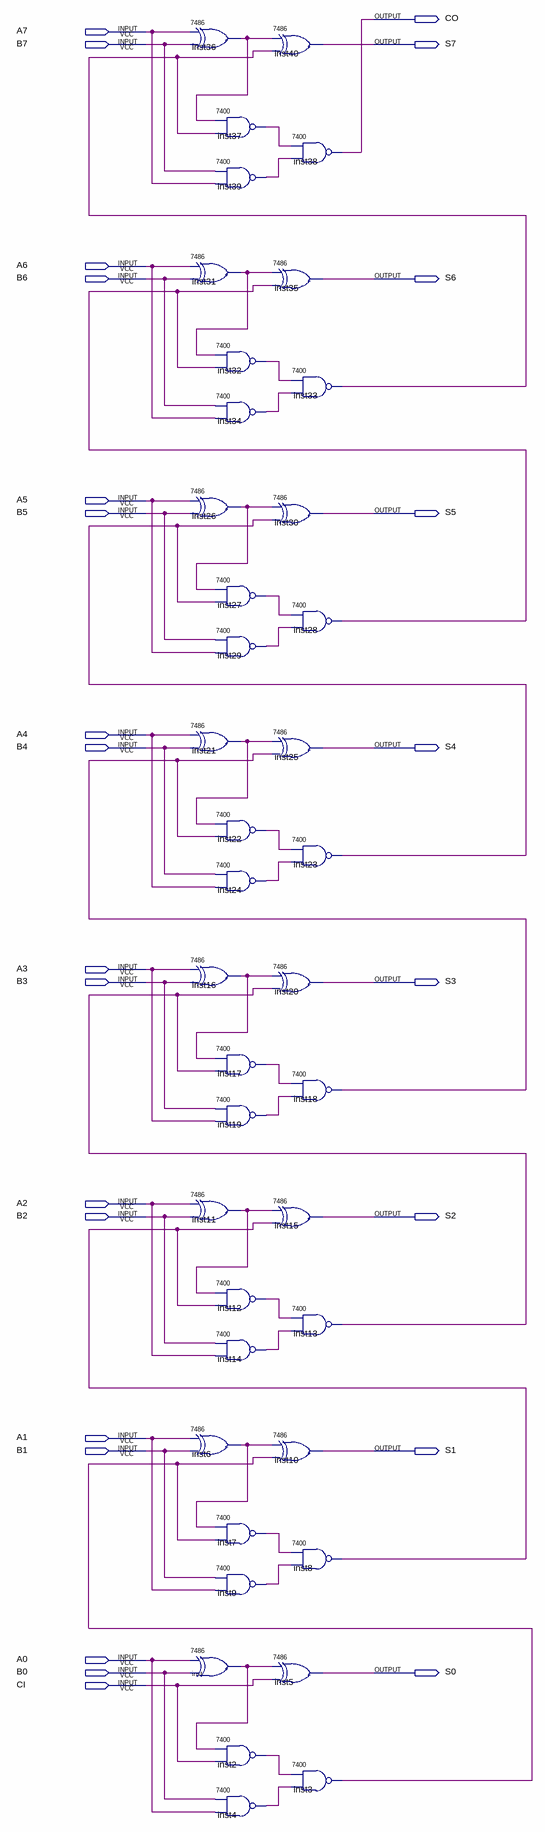
[diagram p0: schematic sheet]
// Quartus schematic adder_8b.bdf as structural Verilog: 40 symbols, 26 pins
module adder_8b (
  input  A7,
  input  B7,
  input  A6,
  input  B6,
  input  A5,
  input  B5,
  input  A4,
  input  B4,
  input  A3,
  input  B3,
  input  A2,
  input  B2,
  input  A1,
  input  B1,
  input  A0,
  input  B0,
  input  CI,
  output CO,
  output S7,
  output S6,
  output S5,
  output S4,
  output S3,
  output S2,
  output S1,
  output S0
);

  wire inst2_1, inst3_1, inst4_1, inst6_1, inst7_1, inst8_1, inst9_1, inst11_1, inst12_1, inst13_1, inst14_1,
       inst16_1, inst17_1, inst18_1, inst19_1, inst21_1, inst22_1, inst23_1, inst24_1, inst26_1, inst27_1,
       inst28_1, inst29_1, inst31_1, inst32_1, inst33_1, inst34_1, inst36_1, inst37_1, inst39_1, inst_1;

  \7486  inst36 (.\2 (A7), .\3 (B7), .\1 (inst36_1));
  \7400  inst37 (.\3 (inst33_1), .\2 (inst36_1), .\1 (inst37_1));
  \7400  inst39 (.\3 (A7), .\2 (B7), .\1 (inst39_1));
  \7486  inst31 (.\2 (A6), .\3 (B6), .\1 (inst31_1));
  \7400  inst32 (.\3 (inst28_1), .\2 (inst31_1), .\1 (inst32_1));
  \7400  inst34 (.\3 (A6), .\2 (B6), .\1 (inst34_1));
  \7486  inst26 (.\2 (A5), .\3 (B5), .\1 (inst26_1));
  \7400  inst27 (.\3 (inst23_1), .\2 (inst26_1), .\1 (inst27_1));
  \7400  inst29 (.\3 (A5), .\2 (B5), .\1 (inst29_1));
  \7486  inst21 (.\2 (A4), .\3 (B4), .\1 (inst21_1));
  \7400  inst22 (.\3 (inst18_1), .\2 (inst21_1), .\1 (inst22_1));
  \7400  inst24 (.\3 (A4), .\2 (B4), .\1 (inst24_1));
  \7486  inst16 (.\2 (A3), .\3 (B3), .\1 (inst16_1));
  \7400  inst17 (.\3 (inst13_1), .\2 (inst16_1), .\1 (inst17_1));
  \7400  inst19 (.\3 (A3), .\2 (B3), .\1 (inst19_1));
  \7486  inst11 (.\2 (A2), .\3 (B2), .\1 (inst11_1));
  \7400  inst12 (.\3 (inst8_1), .\2 (inst11_1), .\1 (inst12_1));
  \7400  inst14 (.\3 (A2), .\2 (B2), .\1 (inst14_1));
  \7486  inst6 (.\2 (A1), .\3 (B1), .\1 (inst6_1));
  \7400  inst7 (.\3 (inst3_1), .\2 (inst6_1), .\1 (inst7_1));
  \7400  inst9 (.\3 (A1), .\2 (B1), .\1 (inst9_1));
  \7486  inst (.\2 (A0), .\3 (B0), .\1 (inst_1));
  \7400  inst2 (.\3 (CI), .\2 (inst_1), .\1 (inst2_1));
  \7400  inst4 (.\3 (A0), .\2 (B0), .\1 (inst4_1));
  \7486  inst40 (.\2 (inst36_1), .\3 (inst33_1), .\1 (S7));
  \7486  inst35 (.\2 (inst31_1), .\3 (inst28_1), .\1 (S6));
  \7486  inst30 (.\2 (inst26_1), .\3 (inst23_1), .\1 (S5));
  \7486  inst25 (.\2 (inst21_1), .\3 (inst18_1), .\1 (S4));
  \7486  inst20 (.\2 (inst16_1), .\3 (inst13_1), .\1 (S3));
  \7486  inst15 (.\2 (inst11_1), .\3 (inst8_1), .\1 (S2));
  \7486  inst10 (.\2 (inst6_1), .\3 (inst3_1), .\1 (S1));
  \7486  inst5 (.\2 (inst_1), .\3 (CI), .\1 (S0));
  \7400  inst38 (.\3 (inst39_1), .\2 (inst37_1), .\1 (CO));
  \7400  inst33 (.\3 (inst34_1), .\2 (inst32_1), .\1 (inst33_1));
  \7400  inst28 (.\3 (inst29_1), .\2 (inst27_1), .\1 (inst28_1));
  \7400  inst23 (.\3 (inst24_1), .\2 (inst22_1), .\1 (inst23_1));
  \7400  inst18 (.\3 (inst19_1), .\2 (inst17_1), .\1 (inst18_1));
  \7400  inst13 (.\3 (inst14_1), .\2 (inst12_1), .\1 (inst13_1));
  \7400  inst8 (.\3 (inst9_1), .\2 (inst7_1), .\1 (inst8_1));
  \7400  inst3 (.\3 (inst4_1), .\2 (inst2_1), .\1 (inst3_1));
endmodule
